# EAGLE design trig3_board_marc1_de0-nano (EAGLE 9.4.2)
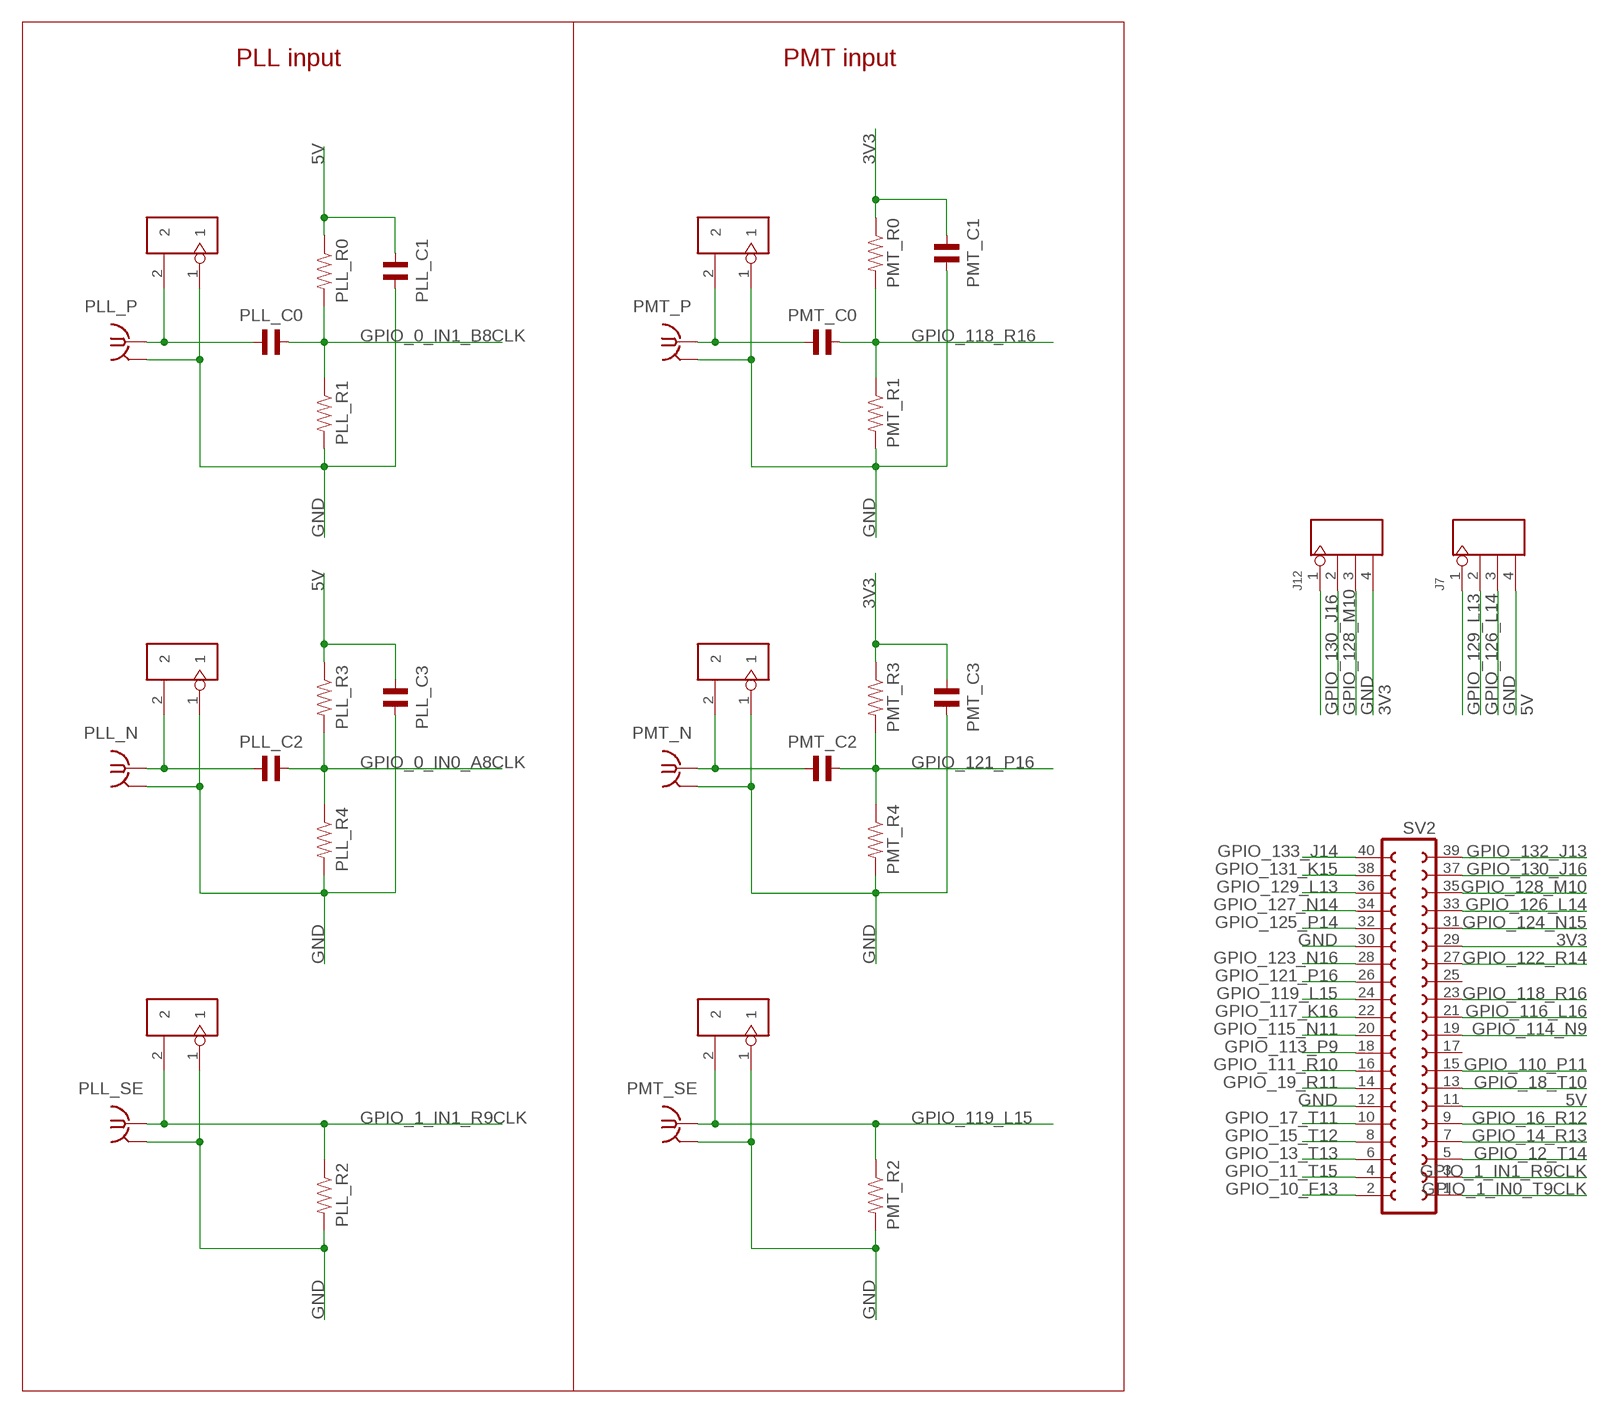
[diagram p0: schematic, sheet 1, part 1 of 2]
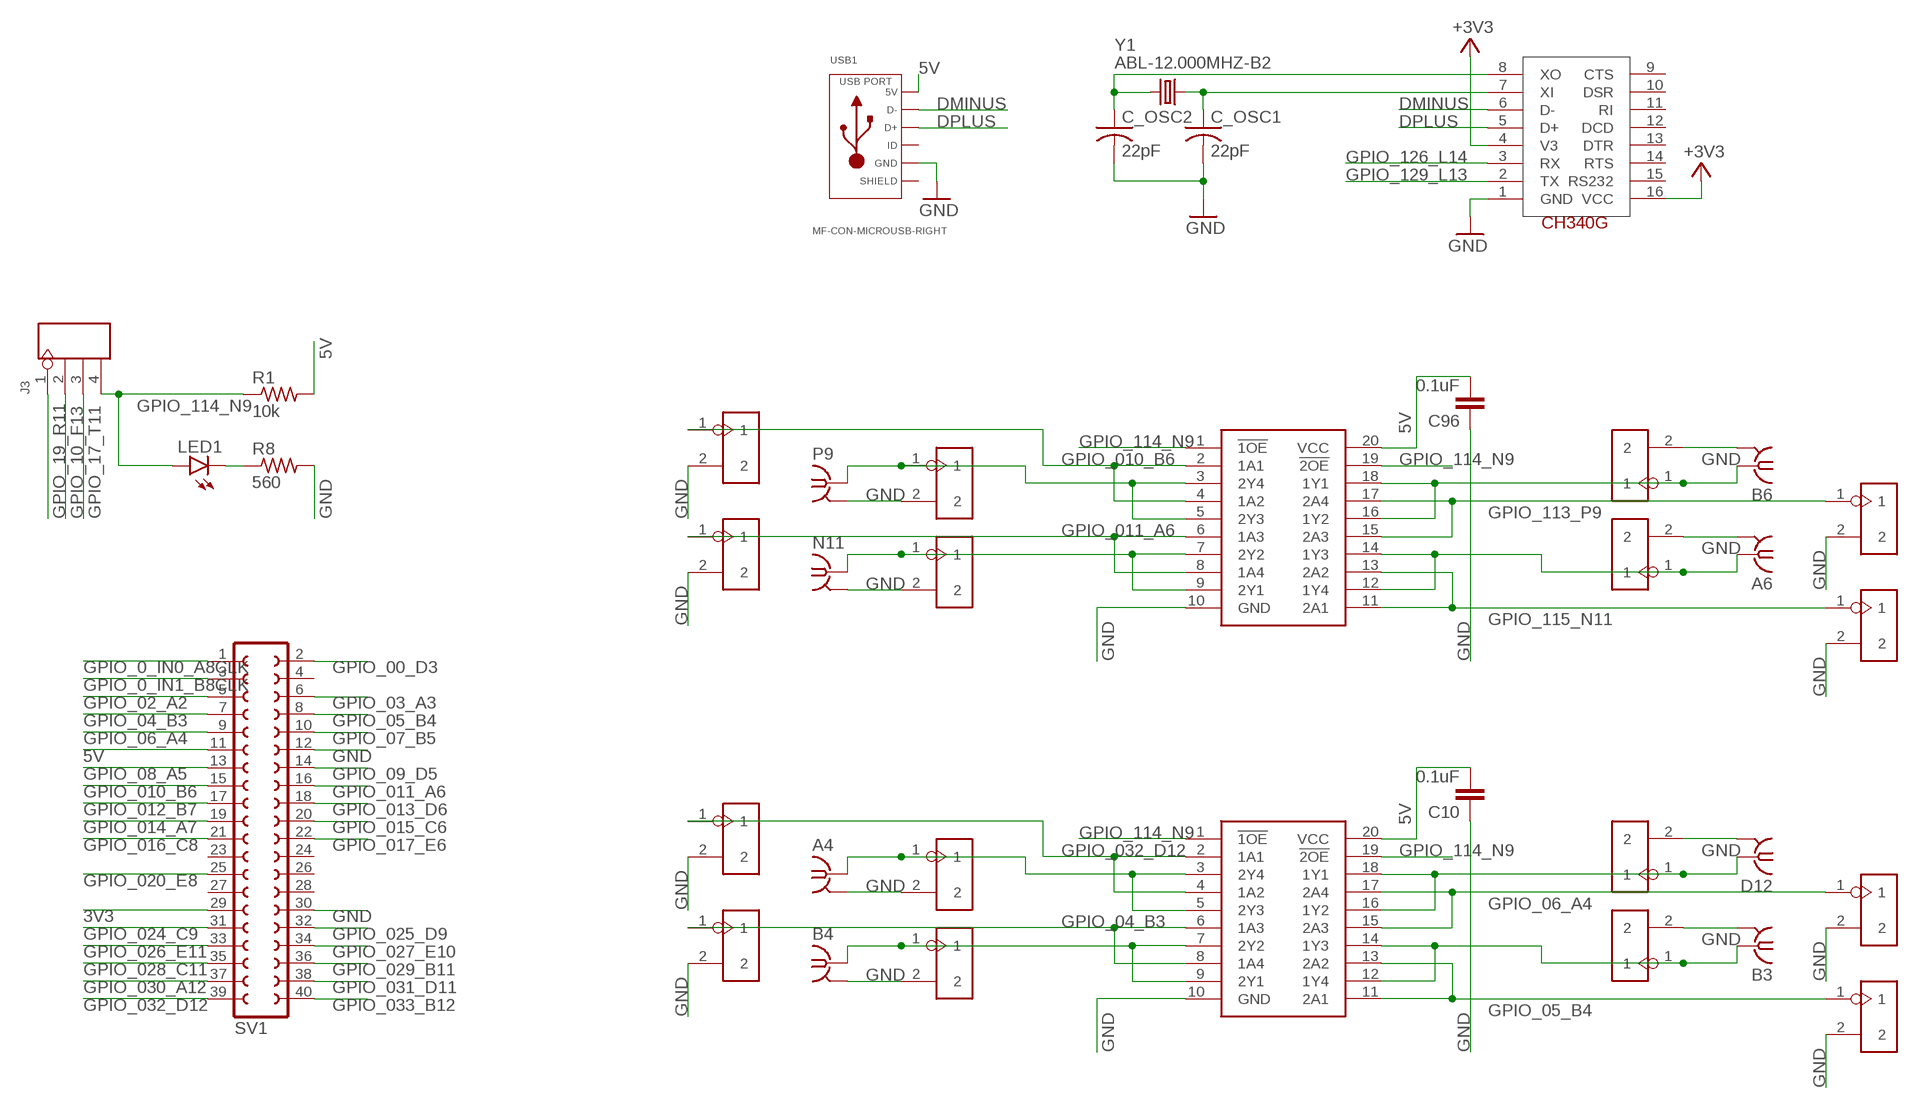
[diagram p1: schematic, sheet 1, part 2 of 2]

## Parts
A4  BU-SMB-V  [BU-SMB-V]
A6  BU-SMB-V  [BU-SMB-V]
B3  BU-SMB-V  [BU-SMB-V]
B4  BU-SMB-V  [BU-SMB-V]
B6  BU-SMB-V  [BU-SMB-V]
C10  0.1uF  CAP0805  [0805]
C96  0.1uF  CAP0805  [0805]
C_OSC1  22pF  C-USC0603  [C0603]
C_OSC2  22pF  C-USC0603  [C0603]
D12  BU-SMB-V  [BU-SMB-V]
J3  4p-2.54  DIP-BLACK-FEMALE-HEADER-VERT(4P-2.54)  [H4-2.54]
J7  4p-2.54  DIP-BLACK-FEMALE-HEADER-VERT(4P-2.54)  [H4-2.54]
J12  4p-2.54  DIP-BLACK-FEMALE-HEADER-VERT(4P-2.54)  [H4-2.54]
LED1  red  LEDCHIP-LED0805  [CHIP-LED0805]
N11  BU-SMB-V  [BU-SMB-V]
OJ41  2p-2.54  DIP-BLACK-MALE-HEADER-VERT(2P-2.54)  [H2-2.54]
OJ42  2p-2.54  DIP-BLACK-MALE-HEADER-VERT(2P-2.54)  [H2-2.54]
OJ43  2p-2.54  DIP-BLACK-MALE-HEADER-VERT(2P-2.54)  [H2-2.54]
OJ44  2p-2.54  DIP-BLACK-MALE-HEADER-VERT(2P-2.54)  [H2-2.54]
OJ45  2p-2.54  DIP-BLACK-MALE-HEADER-VERT(2P-2.54)  [H2-2.54]
OJ46  2p-2.54  DIP-BLACK-MALE-HEADER-VERT(2P-2.54)  [H2-2.54]
OJ47  2p-2.54  DIP-BLACK-MALE-HEADER-VERT(2P-2.54)  [H2-2.54]
OJ48  2p-2.54  DIP-BLACK-MALE-HEADER-VERT(2P-2.54)  [H2-2.54]
OJ89  2p-2.54  DIP-BLACK-MALE-HEADER-VERT(2P-2.54)  [H2-2.54]
OJ90  2p-2.54  DIP-BLACK-MALE-HEADER-VERT(2P-2.54)  [H2-2.54]
OJ91  2p-2.54  DIP-BLACK-MALE-HEADER-VERT(2P-2.54)  [H2-2.54]
OJ92  2p-2.54  DIP-BLACK-MALE-HEADER-VERT(2P-2.54)  [H2-2.54]
OJ93  2p-2.54  DIP-BLACK-MALE-HEADER-VERT(2P-2.54)  [H2-2.54]
OJ94  2p-2.54  DIP-BLACK-MALE-HEADER-VERT(2P-2.54)  [H2-2.54]
OJ95  2p-2.54  DIP-BLACK-MALE-HEADER-VERT(2P-2.54)  [H2-2.54]
OJ96  2p-2.54  DIP-BLACK-MALE-HEADER-VERT(2P-2.54)  [H2-2.54]
P9  BU-SMB-V  [BU-SMB-V]
PLL_C0  1uF  CAPACITOR_NP_0805  [C0805]
PLL_C1  0.1uF  CAPACITOR_NP_0805  [C0805]
PLL_C2  1uF  CAPACITOR_NP_0805  [C0805]
PLL_C3  CAPACITOR_NP_0805  [C0805]
PLL_N  BU-SMB-V  [BU-SMB-V]
PLL_N_J  2p-2.54  DIP-BLACK-MALE-HEADER-VERT(2P-2.54)  [H2-2.54]
PLL_N_J1  2p-2.54  DIP-BLACK-MALE-HEADER-VERT(2P-2.54)  [H2-2.54]
PLL_P  BU-SMB-V  [BU-SMB-V]
PLL_P_J  2p-2.54  DIP-BLACK-MALE-HEADER-VERT(2P-2.54)  [H2-2.54]
PLL_R0  RESISTOR_0805  [R0805]
PLL_R1  RESISTOR_0805  [R0805]
PLL_R2  50ohm  RESISTOR_0805  [R0805]
PLL_R3  RESISTOR_0805  [R0805]
PLL_R4  RESISTOR_0805  [R0805]
PLL_SE  BU-SMB-V  [BU-SMB-V]
PMT_C0  1uF  CAPACITOR_NP_0805  [C0805]
PMT_C1  0.1uF  CAPACITOR_NP_0805  [C0805]
PMT_C2  1uF  CAPACITOR_NP_0805  [C0805]
PMT_C3  CAPACITOR_NP_0805  [C0805]
PMT_N  BU-SMB-V  [BU-SMB-V]
PMT_N_J  2p-2.54  DIP-BLACK-MALE-HEADER-VERT(2P-2.54)  [H2-2.54]
PMT_N_J1  2p-2.54  DIP-BLACK-MALE-HEADER-VERT(2P-2.54)  [H2-2.54]
PMT_P  BU-SMB-V  [BU-SMB-V]
PMT_P_J  2p-2.54  DIP-BLACK-MALE-HEADER-VERT(2P-2.54)  [H2-2.54]
PMT_R0  RESISTOR_0805  [R0805]
PMT_R1  RESISTOR_0805  [R0805]
PMT_R2  50ohm  RESISTOR_0805  [R0805]
PMT_R3  RESISTOR_0805  [R0805]
PMT_R4  RESISTOR_0805  [R0805]
PMT_SE  BU-SMB-V  [BU-SMB-V]
R1  10k  R-US_R0805  [R0805]
R8  560  R-US_R0805  [R0805]
SV1  FE20-2  [FE20-2]
SV2  FE20-2  [FE20-2]
U340G  CH340G  [SOIC16]
USB1  MF-CON-MICROUSB-RIGHT  USB_5PIN_10118193-0001LF  [10118193-0001LF]
VSLUE5  SN74ACT244DW  [SOIC127P1030X265-20N]
VSLUE11  SN74ACT244DW  [SOIC127P1030X265-20N]
Y1  ABL-12.000MHZ-B2  CRYSTALHC49US  [HC49US]

## Nets
3V3 [power]: J12.4 PMT_C1.P$1 PMT_C3.P$1 PMT_R0.P$1 PMT_R3.P$1 SV1.29 SV2.29
5V [power]: C10.2 C96.2 J7.4 PLL_C1.P$1 PLL_C3.P$1 PLL_R0.P$1 PLL_R3.P$1 R1.2 SV1.11 SV2.11 USB1.1(5V) VSLUE5.20(VCC) VSLUE11.20(VCC)
+3V3 [three]: U340G.4(V3) U340G.16(VCC)
DMINUS: U340G.6(D-) USB1.2(D-)
DPLUS: U340G.5(D+) USB1.3(D+)
GND: A4.2 A4.3 A4.4 A4.5 A6.2 A6.3 A6.4 A6.5 B3.2 B3.3 B3.4 B3.5 B4.2 B4.3 B4.4 B4.5 B6.2 B6.3 B6.4 B6.5 C10.1 C96.1 C_OSC1.2 C_OSC2.2 D12.2 D12.3 D12.4 D12.5 J7.3 J12.3 N11.2 N11.3 N11.4 N11.5 OJ41.2 OJ42.2 OJ43.2 OJ44.2 OJ45.2 OJ46.2 OJ47.2 OJ48.2 OJ89.2 OJ90.2 OJ91.2 OJ92.2 OJ93.2 OJ94.2 OJ95.2 OJ96.2 P9.2 P9.3 P9.4 P9.5 PLL_C1.P$2 PLL_C3.P$2 PLL_N.2 PLL_N.3 PLL_N.4 PLL_N.5 PLL_N_J1.1 PLL_N_J.1 PLL_P.2 PLL_P.3 PLL_P.4 PLL_P.5 PLL_P_J.1 PLL_R1.P$2 PLL_R2.P$2 PLL_R4.P$2 PLL_SE.2 PLL_SE.3 PLL_SE.4 PLL_SE.5 PMT_C1.P$2 PMT_C3.P$2 PMT_N.2 PMT_N.3 PMT_N.4 PMT_N.5 PMT_N_J1.1 PMT_N_J.1 PMT_P.2 PMT_P.3 PMT_P.4 PMT_P.5 PMT_P_J.1 PMT_R1.P$2 PMT_R2.P$2 PMT_R4.P$2 PMT_SE.2 PMT_SE.3 PMT_SE.4 PMT_SE.5 R8.2 SV1.12 SV1.30 SV2.12 SV2.30 U340G.1(GND) USB1.5(GND) VSLUE5.10(GND) VSLUE11.10(GND)
GPIO_00_D3: SV1.2
GPIO_0_IN0_A8CLK: PLL_C2.P$2 PLL_R3.P$2 PLL_R4.P$1 SV1.1
GPIO_0_IN1_B8CLK: PLL_C0.P$2 PLL_R0.P$2 PLL_R1.P$1 SV1.3
GPIO_1_IN0_T9CLK: SV2.1
GPIO_1_IN1_R9CLK: PLL_N_J1.2 PLL_R2.P$1 PLL_SE.1 SV2.3
GPIO_02_A2: SV1.5
GPIO_03_A3: SV1.6
GPIO_04_B3: OJ96.1 SV1.7 VSLUE11.6(1A3) VSLUE11.8(1A4)
GPIO_05_B4: OJ94.1 SV1.8 VSLUE11.11(2A1) VSLUE11.13(2A2)
GPIO_06_A4: OJ93.1 SV1.9 VSLUE11.15(2A3) VSLUE11.17(2A4)
GPIO_07_B5: SV1.10
GPIO_08_A5: SV1.13
GPIO_09_D5: SV1.14
GPIO_010_B6: OJ47.1 SV1.15 VSLUE5.2(1A1) VSLUE5.4(1A2)
GPIO_10_F13: J3.2 SV2.2
GPIO_011_A6: OJ48.1 SV1.16 VSLUE5.6(1A3) VSLUE5.8(1A4)
GPIO_11_T15: SV2.4
GPIO_012_B7: SV1.17
GPIO_12_T14: SV2.5
GPIO_013_D6: SV1.18
GPIO_13_T13: SV2.6
GPIO_014_A7: SV1.19
GPIO_14_R13: SV2.7
GPIO_015_C6: SV1.20
GPIO_15_T12: SV2.8
GPIO_016_C8: SV1.21
GPIO_16_R12: SV2.9
GPIO_017_E6: SV1.22
GPIO_17_T11: J3.3 SV2.10
GPIO_18_T10: SV2.13
GPIO_19_R11: J3.1 SV2.14
GPIO_020_E8: SV1.25
GPIO_024_C9: SV1.31
GPIO_025_D9: SV1.32
GPIO_026_E11: SV1.33
GPIO_027_E10: SV1.34
GPIO_028_C11: SV1.35
GPIO_029_B11: SV1.36
GPIO_030_A12: SV1.37
GPIO_031_D11: SV1.38
GPIO_032_D12: OJ95.1 SV1.39 VSLUE11.2(1A1) VSLUE11.4(1A2)
GPIO_033_B12: SV1.40
GPIO_110_P11: SV2.15
GPIO_111_R10: SV2.16
GPIO_113_P9: OJ45.1 SV2.18 VSLUE5.15(2A3) VSLUE5.17(2A4)
GPIO_114_N9: J3.4 LED1.A R1.1 SV2.19 VSLUE5.1(!1OE) VSLUE5.19(!2OE) VSLUE11.1(!1OE) VSLUE11.19(!2OE)
GPIO_115_N11: OJ46.1 SV2.20 VSLUE5.11(2A1) VSLUE5.13(2A2)
GPIO_116_L16: SV2.21
GPIO_117_K16: SV2.22
GPIO_118_R16: PMT_C0.P$2 PMT_R0.P$2 PMT_R1.P$1 SV2.23
GPIO_119_L15: PMT_N_J1.2 PMT_R2.P$1 PMT_SE.1 SV2.24
GPIO_121_P16: PMT_C2.P$2 PMT_R3.P$2 PMT_R4.P$1 SV2.26
GPIO_122_R14: SV2.27
GPIO_123_N16: SV2.28
GPIO_124_N15: SV2.31
GPIO_125_P14: SV2.32
GPIO_126_L14: J7.2 SV2.33 U340G.3(RX)
GPIO_127_N14: SV2.34
GPIO_128_M10: J12.2 SV2.35
GPIO_129_L13: J7.1 SV2.36 U340G.2(TX)
GPIO_130_J16: J12.1 SV2.37
GPIO_131_K15: SV2.38
GPIO_132_J13: SV2.39
GPIO_133_J14: SV2.40
N$2: PMT_C0.P$1 PMT_P.1 PMT_P_J.2
N$8: PMT_C2.P$1 PMT_N.1 PMT_N_J.2
N$9: LED1.C R8.1
N$14: PLL_C0.P$1 PLL_P.1 PLL_P_J.2
N$19: PLL_C2.P$1 PLL_N.1 PLL_N_J.2
N$23: C_OSC1.1 U340G.7(XI) Y1.1
N$31: C_OSC2.1 U340G.8(XO) Y1.2
OUT21: B6.1 OJ44.1 VSLUE5.16(1Y2) VSLUE5.18(1Y1)
OUT22: A6.1 OJ43.1 VSLUE5.12(1Y4) VSLUE5.14(1Y3)
OUT23: OJ41.1 P9.1 VSLUE5.3(2Y4) VSLUE5.5(2Y3)
OUT24: N11.1 OJ42.1 VSLUE5.7(2Y2) VSLUE5.9(2Y1)
OUT45: D12.1 OJ92.1 VSLUE11.16(1Y2) VSLUE11.18(1Y1)
OUT46: B3.1 OJ91.1 VSLUE11.12(1Y4) VSLUE11.14(1Y3)
OUT47: A4.1 OJ89.1 VSLUE11.3(2Y4) VSLUE11.5(2Y3)
OUT48: B4.1 OJ90.1 VSLUE11.7(2Y2) VSLUE11.9(2Y1)
Unconnected: SV1.4 SV1.23 SV1.24 SV1.26 SV1.27 SV1.28 SV2.17 SV2.25 U340G.9(CTS) U340G.10(DSR) U340G.11(RI) U340G.12(DCD) U340G.13(DTR) U340G.14(RTS) U340G.15(RS232) USB1.4(ID)

## Notes on the sheet
- PLL input | PMT input

## Power pins joined to a net without a drawn wire
SLD: USB1.S1(SLD) USB1.S2(SLD) USB1.S3(SLD) USB1.S4(SLD)

## Library data of the parts
A4 A6 B3 B4 B6 D12 N11 P9 PLL_N PLL_P PLL_SE PMT_N PMT_P PMT_SE = con-coax:BU-SMB-V: FEMALE SMB CONNECTOR Radiall distributor RS 112-2993; OC_FARNELL: unknown; OC_NEWARK: unknown
C10 C96 = SparkFun-Capacitors:CAP: Capacitor Standard 0603 ceramic capacitor, and 0.1" leaded capacitor.
C_OSC1 C_OSC2 = rcl@1:C-US: CAPACITOR, American symbol; MFN: MF-CAP-0603-22pF
J3 J7 J12 = Seeed-Connector:DIP-BLACK-FEMALE-HEADER-VERT(4P-2.54): 320030017; MPN: F185-1104A1BSYA1
LED1 = led:LED: LED OSRAM: - CHIPLED LG R971, LG N971, LY N971, LG Q971, LY Q971, LO R971, LY R971 LH N974, LH R974 LS Q976, LO Q976, LY Q976 LO Q996 - Hyper CHIPLED LW Q18S LB Q993, LB Q99A, LB R99A - SideLED LS A670, LO A670, LY A670, LG A670, LP A670 LB A673, LV A673, LT A673, LW A673 LH A674 LY A675 LS A676, LA A676, LO A676, LY A676, LW A676 LS A679, LY A679, LG A679 - Hyper Micro SIDELED® LS Y876, LA Y876, LO Y876, LY Y876 LT Y87S - SmartLED LW L88C, LW L88S LB L89C, LB L89S, LG L890 LS L89K, LO L89K, LY L89K LS L896, LA L896, LO L896, LY L896 - TOPLED LS T670, LO T670, LY T670, LG T670, LP T670 LSG T670, LSP T670, LSY T670, LOP T670, LYG T670 LG T671, LOG T671, LSG T671 LB T673, LV T673, LT T673, LW T673 LH T674 LS T676, LA T676, LO T676, LY T676, LB T676, LH T676, LSB T676, LW T676 LB T67C, LV T67C, LT T67C, LS T67K, LO T67K, LY T67K, LW E67C LS E67B, LA E67B, LO E67B, LY E67B, LB E67C, LV E67C, LT E67C LW T67C LS T679, LY T679, LG T679 LS T770, LO T770, LY T770, LG T770, LP T770 LB T773, LV T773, LT T773, LW T773 LH T774 LS E675, LA E675, LY E675, LS T675 LS T776, LA T776, LO T776, LY T776, LB T776 LHGB T686 LT T68C, LB T68C - Hyper Mini TOPLED® LB M676 - Mini TOPLED Santana® LG M470 LS M47K, LO M47K, LY M47K Source: http://www.osram.convergy.de LUXEON: - LUMILED® LXK2-PW12-R00, LXK2-PW12-S00, LXK2-PW14-U00, LXK2-PW14-V00 LXK2-PM12-R00, LXK2-PM12-S00, LXK2-PM14-U00 LXK2-PE12-Q00, LXK2-PE12-R00, LXK2-PE12-S00, LXK2-PE14-T00, LXK2-PE14-U00 LXK2-PB12-K00, LXK2-PB12-L00, LXK2-PB12-M00, LXK2-PB14-N00, LXK2-PB14-P00, LXK2-PB14-Q00 LXK2-PR12-L00, LXK2-PR12-M00, LXK2-PR14-Q00, LXK2-PR14-R00 LXK2-PD12-Q00, LXK2-PD12-R00, LXK2-PD12-S00 LXK2-PH12-R00, LXK2-PH12-S00 LXK2-PL12-P00, LXK2-PL12-Q00, LXK2-PL12-R00 Source: www.luxeon.com KINGBRIGHT: KA-3528ASYC Source: www.kingbright.com
OJ41-OJ48 OJ89-OJ96 PLL_N_J PLL_N_J1 PLL_P_J PMT_N_J PMT_N_J1 PMT_P_J = Seeed-Connector:DIP-BLACK-MALE-HEADER-VERT(2P-2.54): 320020016; MPN: P125-1102A0BS116A1
PLL_C0 PLL_C1-PLL_C3 PMT_C0 PMT_C1-PMT_C3 = MF_Passives:CAPACITOR_NP: Library: MF_Passives Description: Device for Non-Polarized Capacitors. Manufacture part number (MPN) can be added via Attributes. Check https://factory.macrofab.com/parts for the house parts list.; POPULATE: 1
PLL_R0 PLL_R1-PLL_R4 PMT_R0 PMT_R1-PMT_R4 = MF_Passives:RESISTOR: Library: MF_Passives Description: Device for Resistors. Manufacture part number (MPN), Voltage, Tolerance, and Wattage Rating can be added via Attributes. Check https://factory.macrofab.com/parts for the house parts list.; POPULATE: 1
R1 = adafruit:R-US_: RESISTOR, American symbol
R8 = resistor:R-US_: RESISTOR, American symbol
SV1 SV2 = con-lsta:FE20-2: FEMALE HEADER; OC_FARNELL: unknown; OC_NEWARK: unknown
U340G = usb-serial:CH340G
USB1 = PP_Connectors:USB_5PIN; POPULATE: 1
VSLUE5 VSLUE11 = SN74ACT244DW:SN74ACT244DW: SN74ACT244DW, 8-Bit Buffer, Line Driver, ACT, 3-State Non-Inverting 4.5 5.5 V 20-Pin SOIC Source: Datasheet <http://www.ti.com/lit/ds/symlink/sn74act244.pdf>; ARROW_PART_NUMBER: SN74ACT244DW; ARROW_PRICE-STOCK: https://www.arrow.com/en/products/sn74act244dw/texas-instruments; DESCRIPTION: SN74ACT244DW, 8-Bit Buffer, Line Driver, ACT, 3-State Non-Inverting 4.5 5.5 V 20-Pin SOIC; HEIGHT: 2.65mm; MANUFACTURER_NAME: Texas Instruments; MANUFACTURER_PART_NUMBER: SN74ACT244DW; RS_PART_NUMBER: 4363169; RS_PRICE-STOCK: http://uk.rs-online.com/web/p/products/4363169
Y1 = SparkFun-FreqCtrl:CRYSTAL: Various standard crystals. Proven footprints.

## Net classes
0 default: width 0.254 mm
1 power: width 0.762 mm
2 three: width 0.152 mm
3 five: width 0.381 mm

## Board
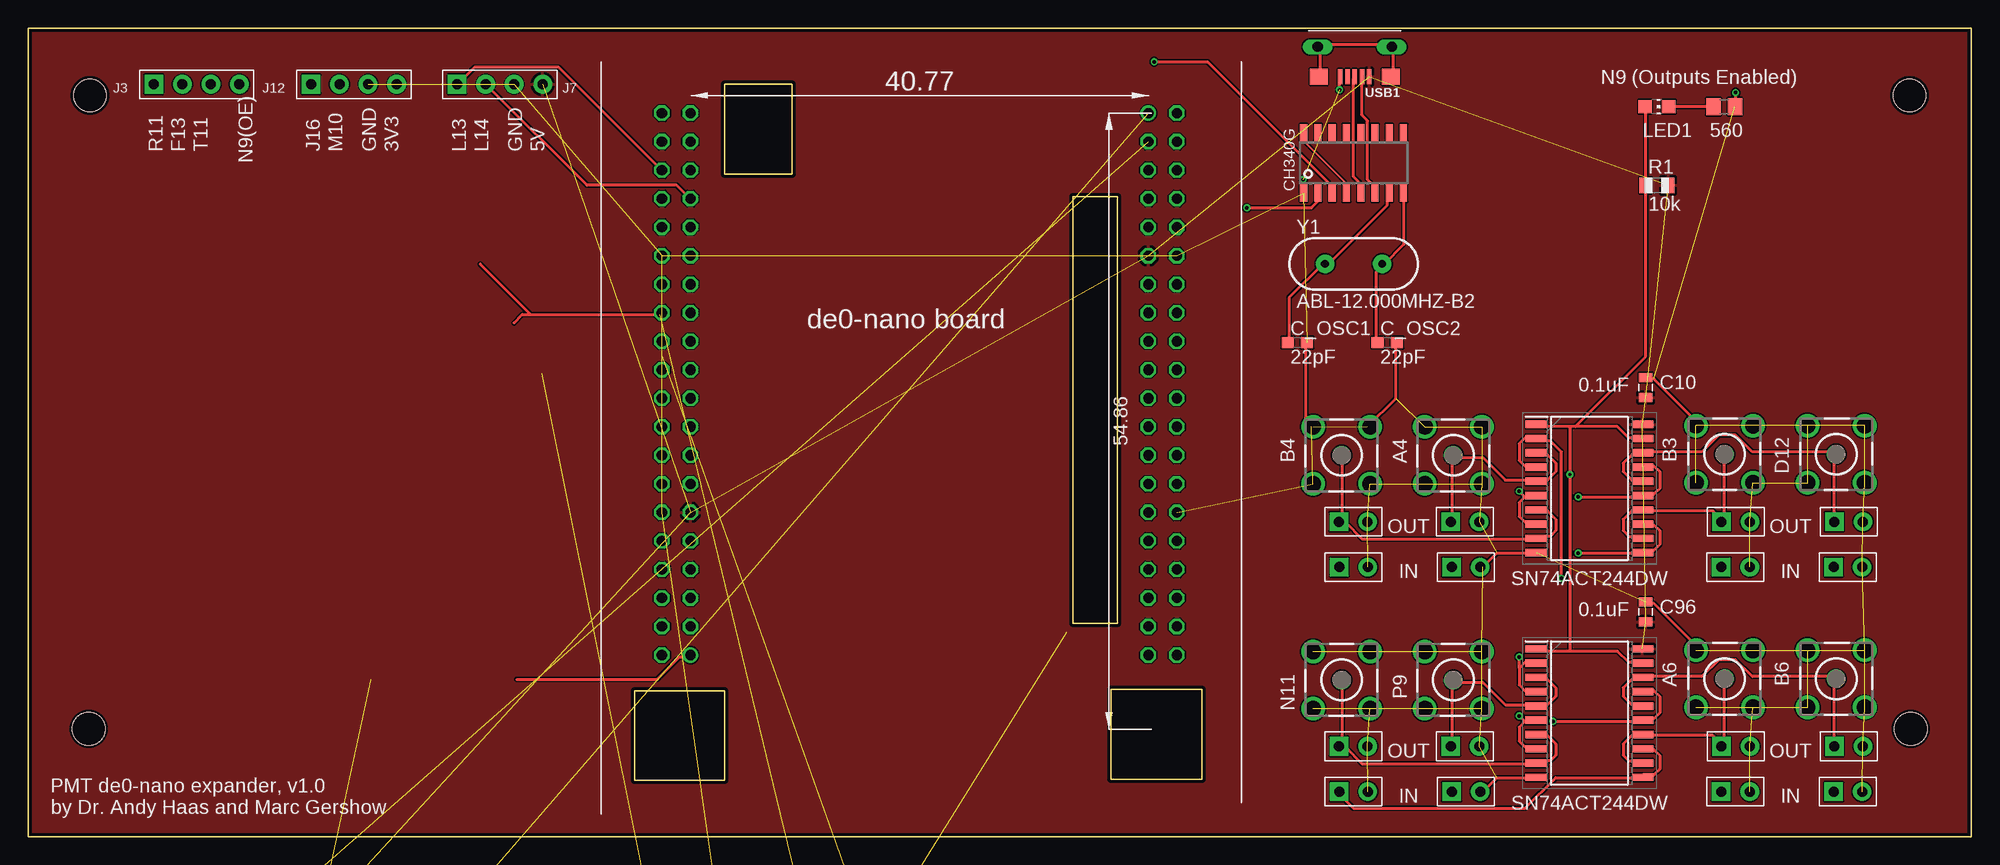
[diagram p2: board, top side]
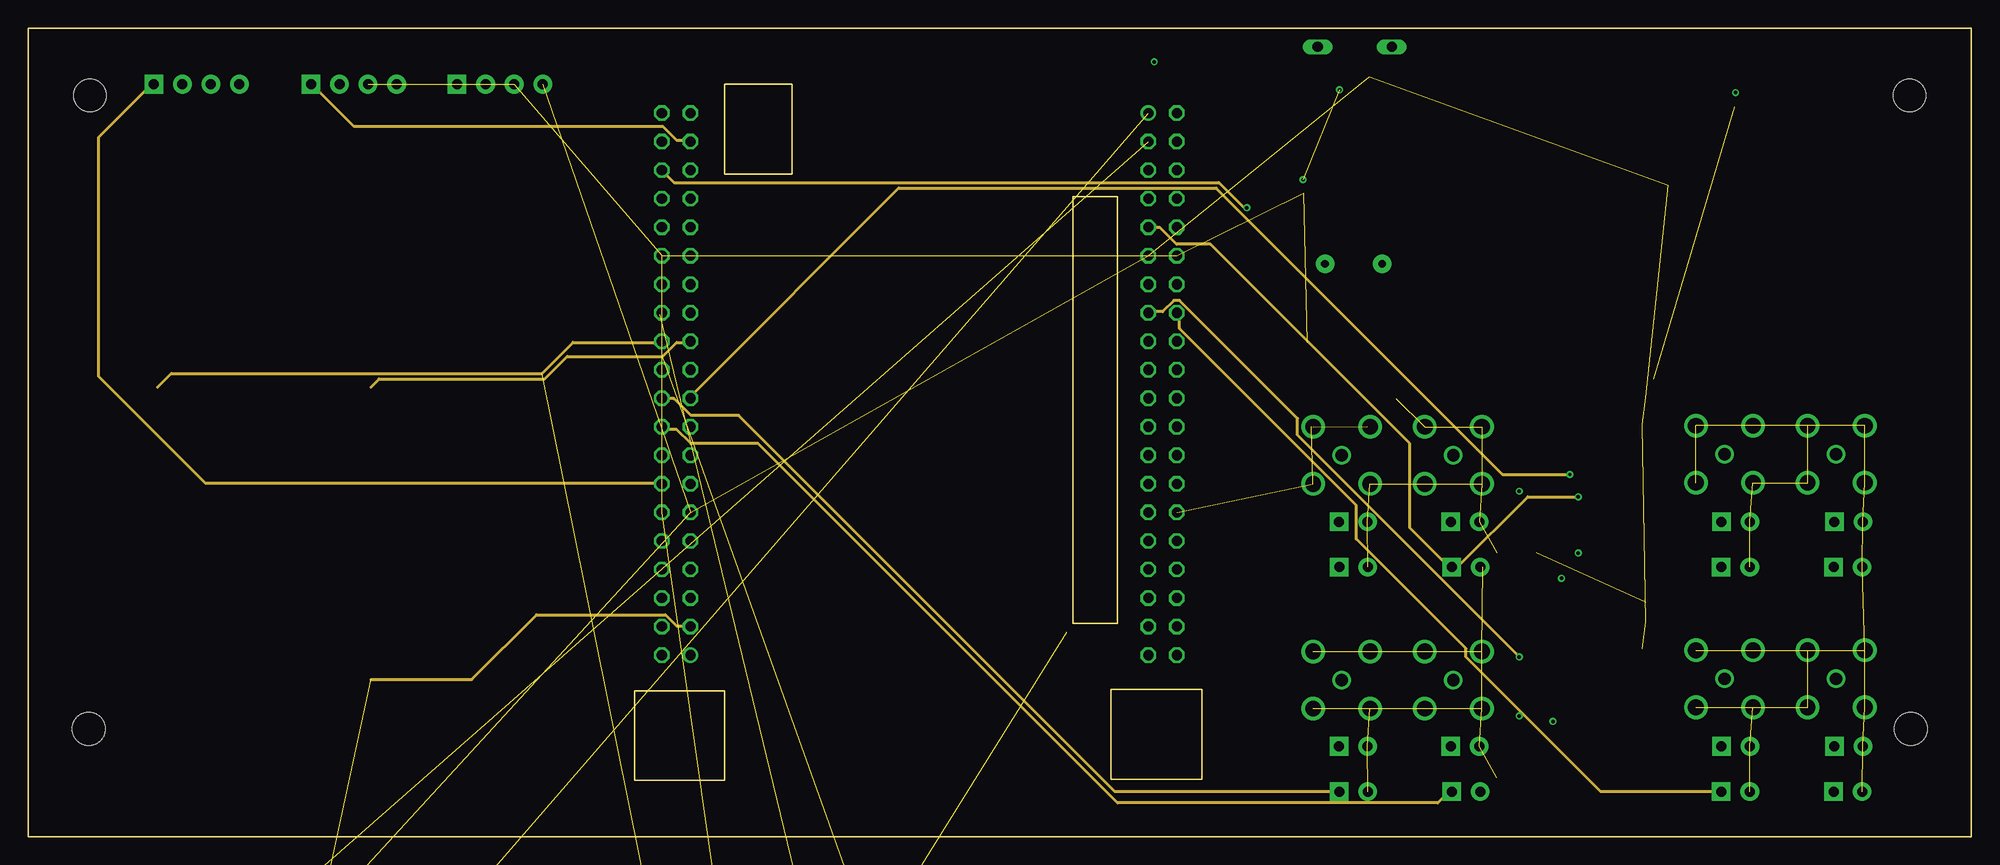
[diagram p3: board, inner layer Route2]
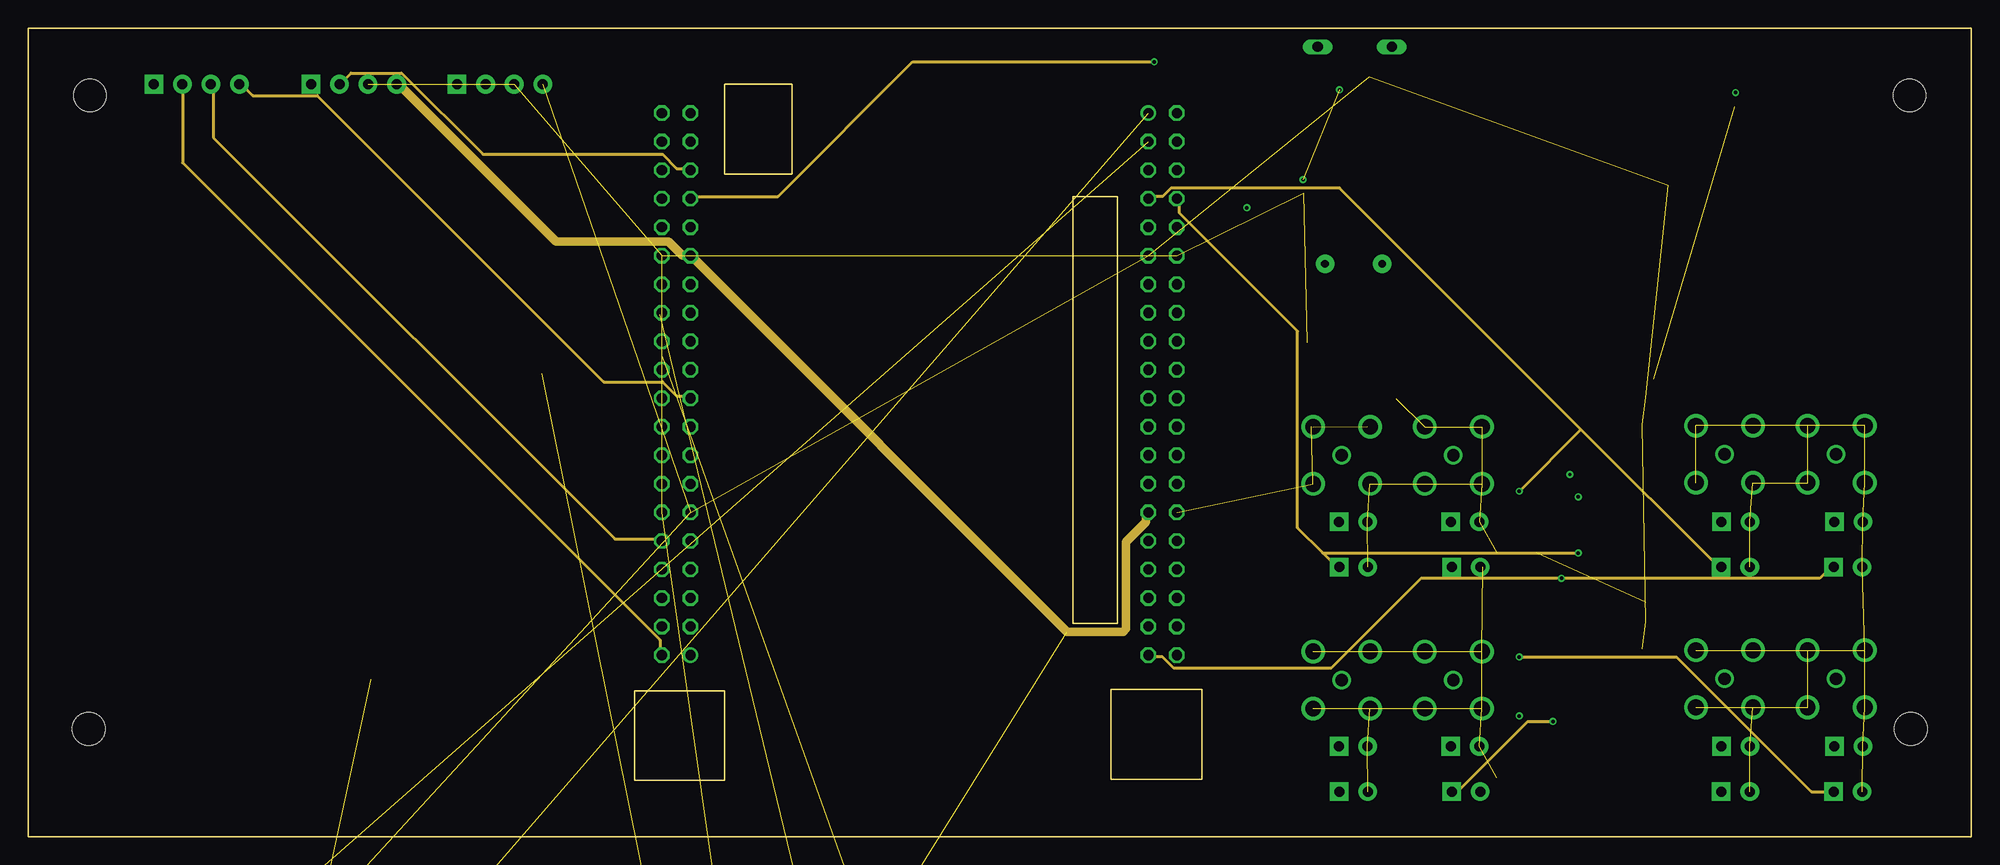
[diagram p4: board, inner layer Route15]
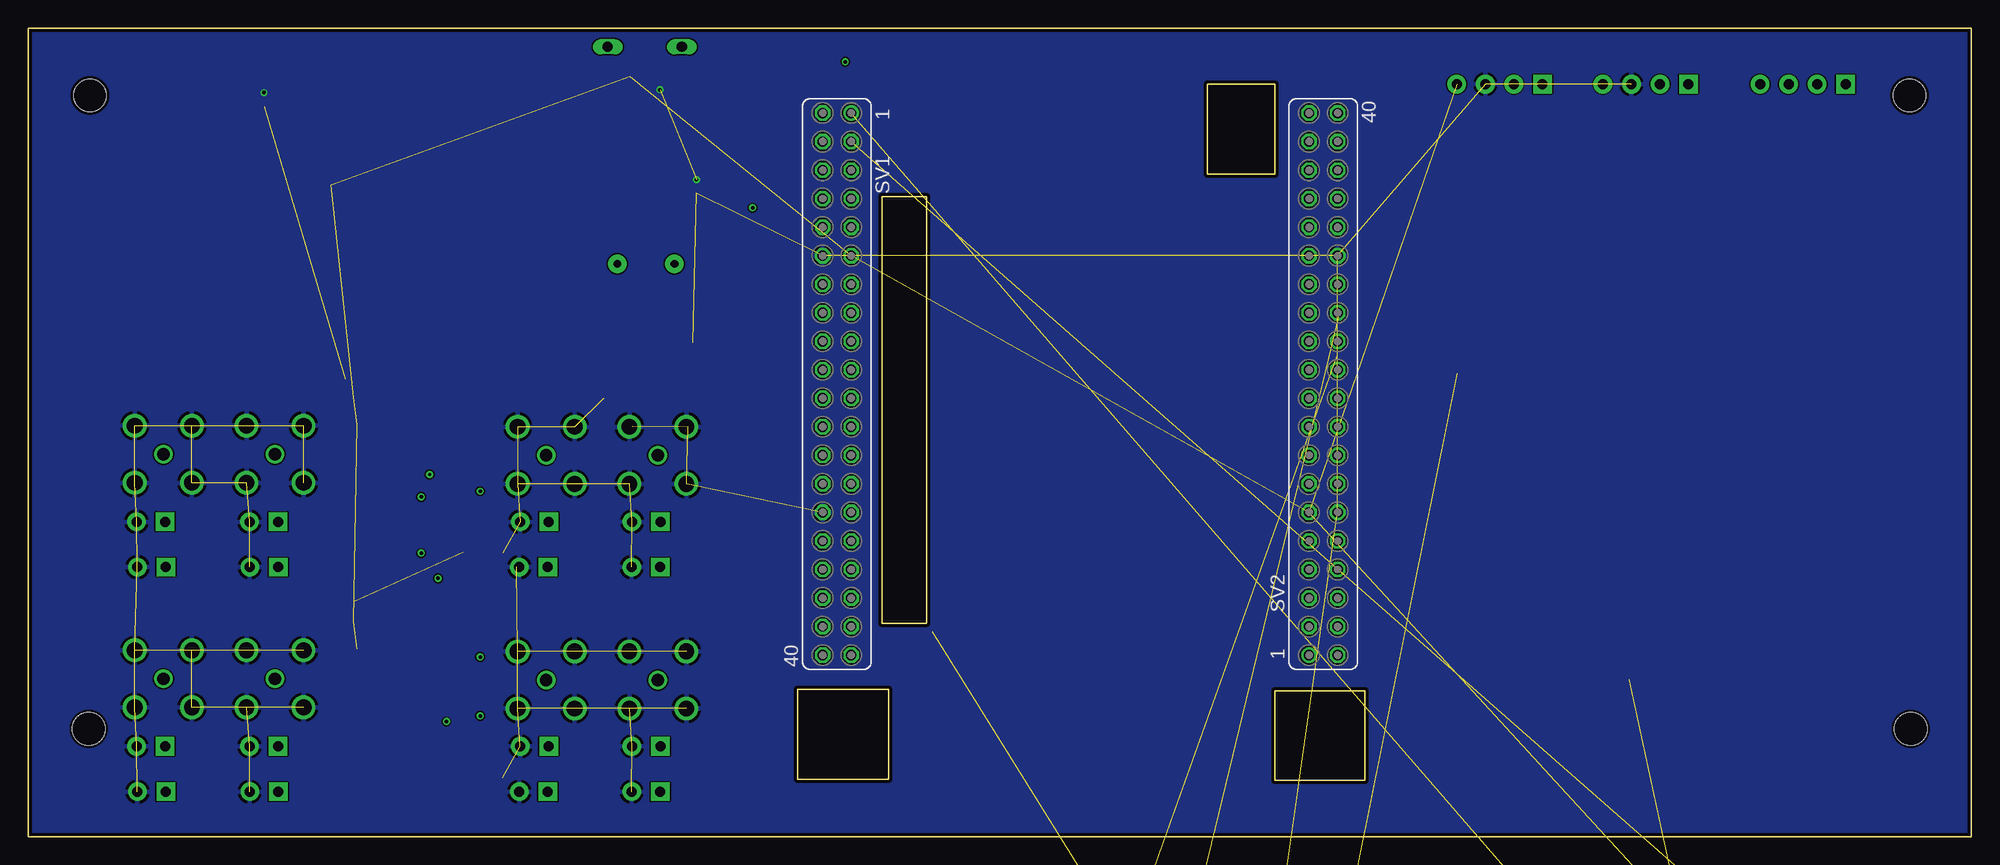
[diagram p5: board, bottom side, seen from below]

Size 173 x 72 mm. Coordinates in mm from the lower left corner, seen from the top.
Outline: 104.5,13.1 104.5,5.1 96.4,5.1 96.4,13.1 104.5,13.1
Outline: 62,13 62,5 54,5 54,13 62,13
Outline: 97,57 97,19 93,19 93,57 97,57
Outline: 62,59 62,67 68,67 68,59 62,59
Outline: 0,72 0,0 173,0 173,72 0,72
Copper layers (1*2*15*16): Top 0.035mm / dielectric 0.23mm / Route2 0.035mm / dielectric 0.93mm / Route15 0.035mm / dielectric 0.23mm / Bottom 0.035mm
Design rules "MF_Standard_4_Layer": minimum track width 5mil, minimum drill 12mil, track to track 5mil, track to pad 5mil, pad to pad 5mil, via to via 5mil, smd to smd 0mil, copper to edge 10mil, drill to drill 10mil, minimum pad ring 6mil, minimum via ring 6mil, stop-mask expansion 2mil, vias tented up to drill 25mil, thermal gap 10mil
Holes 2.9 mm at 5.4,9.6 167.6,9.6 5.5,66 167.5,66

### Footprints (pad centres in the part's own frame; a part is rotated, then mirrored left to right if it is on the bottom)
BU-SMB-V = drill 1.1: 1 0,0 | drill 1.4: 2 -2.54,2.54; 3 2.54,2.54; 4 2.54,-2.54; 5 -2.54,-2.54
0805 = smd 0.8 x 1.2: 1 -0.9,0; 2 0.9,0
C0603 = smd 1.1 x 1: 1 -0.85,0; 2 0.85,0
H4-2.54 = drill 0.889 pad 1.651 square: 1 0,3.81 | drill 0.889 pad 1.651: 2 0,1.27; 3 0,-1.27; 4 0,-3.81
CHIP-LED0805 = smd 1.2 x 1.2: A 0,-1.05; C 0,1.05
H2-2.54 = drill 0.889 pad 1.651 square: 1 0,1.27 | drill 0.889 pad 1.651: 2 0,-1.27
C0805 = smd 0.7 x 1.3: P$1 -0.95,0; P$2 0.95,0
R0805 = smd 0.7 x 1.3: P$1 -0.95,0; P$2 0.95,0
R0805' = smd 1.1 x 1.4: 1 -1,0; 2 1,0
R0805'' = smd 1.3 x 1.5: 1 -0.95,0; 2 0.95,0
FE20-2 = drill 0.914: 1 -24.13,1.27 | drill 0.914 octagon: 2 -24.13,-1.27; 3 -21.59,1.27; 4 -21.59,-1.27; 5 -19.05,1.27; 6 -19.05,-1.27; 7 -16.51,1.27; 8 -16.51,-1.27; 9 -13.97,1.27; 10 -13.97,-1.27; 11 -11.43,1.27; 12 -11.43,-1.27; 13 -8.89,1.27; 14 -8.89,-1.27; 15 -6.35,1.27; 16 -6.35,-1.27; 17 -3.81,1.27; 18 -3.81,-1.27; 19 -1.27,1.27; 20 -1.27,-1.27; 21 1.27,1.27; 22 1.27,-1.27; 23 3.81,1.27; 24 3.81,-1.27; 25 6.35,1.27; 26 6.35,-1.27; 27 8.89,1.27; 28 8.89,-1.27; 29 11.43,1.27; 30 11.43,-1.27; 31 13.97,1.27; 32 13.97,-1.27; 33 16.51,1.27; 34 16.51,-1.27; 35 19.05,1.27; 36 19.05,-1.27; 37 21.59,1.27; 38 21.59,-1.27; 39 24.13,1.27; 40 24.13,-1.27
SOIC16 = smd 0.635 x 1.524: 1 -4.445,-2.695; 2 -3.175,-2.695; 3 -1.905,-2.695; 4 -0.635,-2.695; 5 0.635,-2.695; 6 1.905,-2.695; 7 3.175,-2.695; 8 4.445,-2.695; 9 4.445,2.695; 10 3.175,2.695; 11 1.905,2.695; 12 0.635,2.695; 13 -0.635,2.695; 14 -1.905,2.695; 15 -3.175,2.695; 16 -4.445,2.695
10118193-0001LF = smd 0.4 x 1.35: 1 -1.3,2.54; 2 -0.65,2.54; 3 0,2.54; 4 0.65,2.54; 5 1.3,2.54 | drill 0.9 long: S1 -3.3,-0.135; S2 3.3,-0.135 | smd 1.6 x 1.4: S3 -3.2,2.54; S4 3.2,2.54
SOIC127P1030X265-20N = smd 1.95 x 0.65: 1 -4.725,5.715; 2 -4.725,4.445; 3 -4.725,3.175; 4 -4.725,1.905; 5 -4.725,0.635; 6 -4.725,-0.635; 7 -4.725,-1.905; 8 -4.725,-3.175; 9 -4.725,-4.445; 10 -4.725,-5.715; 11 4.725,-5.715; 12 4.725,-4.445; 13 4.725,-3.175; 14 4.725,-1.905; 15 4.725,-0.635; 16 4.725,0.635; 17 4.725,1.905; 18 4.725,3.175; 19 4.725,4.445; 20 4.725,5.715
HC49US = drill 0.7 pad 1.651: 1 -2.54,0; 2 2.54,0

### Placement (x,y rotation side)
A4  126.88,33.95 180 top
A6  151.02,14.05 0 top
B3  151.02,34.05 0 top
B4  116.93,33.95 180 top
B6  160.96,14.05 0 top
C10  144,40 270 top
C96  144,20 270 top
C_OSC1  113,44 0 top
C_OSC2  121,44 0 top
D12  160.96,34.05 0 top
J3  15,67 90 top
J7  42,67 90 top
J12  29,67 90 top
LED1  145,65 270 top
N11  116.93,13.95 180 top
OJ41  127.92,8.04 90 top
OJ42  117.97,8.04 90 top
OJ43  152.02,8.04 90 top
OJ44  162.07,8.04 90 top
OJ45  128,4 90 top
OJ46  118,4 90 top
OJ47  162,4 90 top
OJ48  152,4 90 top
OJ89  127.92,28.04 90 top
OJ90  117.97,28.04 90 top
OJ91  152.02,28.04 90 top
OJ92  162.07,28.04 90 top
OJ93  128,24 90 top
OJ94  118,24 90 top
OJ95  162,24 90 top
OJ96  152,24 90 top
P9  126.88,13.95 180 top
PLL_C0  17,-10 0 top  (outside the outline)
PLL_C1  17,-14 0 top  (outside the outline)
PLL_C2  17,-30 0 top  (outside the outline)
PLL_C3  17,-34 0 top  (outside the outline)
PLL_N  10,-36 0 top  (outside the outline)
PLL_N_J  3,-36 0 top  (outside the outline)
PLL_N_J1  3,-53 0 top  (outside the outline)
PLL_P  7,-16 0 top  (outside the outline)
PLL_P_J  0,-16 0 top  (outside the outline)
PLL_R0  17,-18 0 top  (outside the outline)
PLL_R1  17,-22 0 top  (outside the outline)
PLL_R2  17,-53 0 top  (outside the outline)
PLL_R3  17,-38 0 top  (outside the outline)
PLL_R4  17,-42 0 top  (outside the outline)
PLL_SE  9,-53 0 top  (outside the outline)
PMT_C0  74,-9 0 top  (outside the outline)
PMT_C1  74,-13 0 top  (outside the outline)
PMT_C2  74,-31 0 top  (outside the outline)
PMT_C3  74,-35 0 top  (outside the outline)
PMT_N  65,-36 0 top  (outside the outline)
PMT_N_J  58,-36 0 top  (outside the outline)
PMT_N_J1  58,-54 0 top  (outside the outline)
PMT_P  65,-16 0 top  (outside the outline)
PMT_P_J  59,-16 0 top  (outside the outline)
PMT_R0  74,-17 0 top  (outside the outline)
PMT_R1  74,-21 0 top  (outside the outline)
PMT_R2  74,-54 0 top  (outside the outline)
PMT_R3  74,-39 0 top  (outside the outline)
PMT_R4  74,-43 0 top  (outside the outline)
PMT_SE  65,-54 0 top  (outside the outline)
R1  10k  [R0805']  145,58 0 top
R8  560  [R0805'']  151,65 0 top
SV1  101,40.3 270 bottom
SV2  57.7,40.3 90 bottom
U340G  118,60 0 top
USB1  118.1,70.2 180 top
VSLUE5  139,11 0 top
VSLUE11  139,31 0 top
Y1  118,51 0 top

### Tracks (layer width: path | path; a pad name or v marks a point on that pad's centre or on a via)
3V3  (4 unrouted)
  Route15 0.762: J12.4 33,67 47,53 57,53 58.25,51.75 58.75,51.75 SV2.29 59.25,51.5 92.5,18.25 97.5,18.25 97.75,18.5 97.75,26.25 99.5,28 99.5,28.75 SV1.29
5V  (12 unrouted)
  pour Top: -6,75 177,75 177,-4 -6,-4
+3V3
  Top 0.152: U340G.4 117.25,57.5 117.25,58.25 113.5,62 113.5,62.5 U340G.16
DMINUS
  Top 0.254: USB1.2 118.75,64.25 119.25,63.75 119.25,58.5 119.75,58 119.75,57.5 U340G.6
DPLUS
  Top 0.254: USB1.3 118,67.5 118,58.75 118.75,58 118.75,57.5 U340G.5
GND  (via drill 0.3)  (96 unrouted)
  Top 0.254: C_OSC1.2 113.75,44 113.75,37 114.25,36.5 B4.4 | C_OSC2.2 121.75,44 121.75,39 119.25,36.5 B4.5 | C96.1 144,20.75 144.75,20.75 148.25,17.25 148.25,16.75 A6.2 | C10.1 144,40.75 144.75,40.75 148.25,37.25 148.25,36.75 B3.2 | v116.75,66.5 116.75,67.5 USB1.5 | v152,66.25 152,65 R8.2 | v113.5,58.5 113.5,57.5 U340G.1 | VSLUE5.10 134.25,5.25 130.75,5.25 129.5,4 OJ45.2 | VSLUE11.10 134.25,25.25 130.75,25.25 129.5,24 OJ93.2
  pour Bottom: 175,77 175,-2 -2,-2 -2,77
GPIO_0_IN0_A8CLK  (3 unrouted)
GPIO_0_IN1_B8CLK  (3 unrouted)
GPIO_1_IN0_T9CLK
  Top 0.254: 43.5,14 56,14 58,16 58.75,16 SV2.1
GPIO_1_IN1_R9CLK  (3 unrouted)
  Route2 0.254: 30.5,14 39.5,14 45.25,19.75 56.75,19.75 57.75,18.75 58.75,18.75 SV2.3
GPIO_04_B3  (via drill 0.3)
  Top 0.254: 133.25,30.25 132.75,29.75 132.75,28.5 133.25,28 134.25,28 VSLUE11.8 | 133.25,30.25 134.25,30.25 VSLUE11.6 | v132.75,30.75 133.25,30.25
  Route15 0.254: 138.25,36.25 150.5,24 OJ96.1 | 138.25,36.25 116.75,57.75 101.75,57.75 101,57 99.75,57 SV1.7 | 138.25,36.25 v132.75,30.75
GPIO_05_B4  (via drill 0.3)
  Top 0.254: VSLUE11.13 143.75,27.75 144.75,27.75 145.25,27.25 145.25,26 144.75,25.5 143.75,25.5 VSLUE11.11 143.5,25.25 v138,25.25
  Route15 0.254: 115.25,25.25 116.5,24 OJ94.1 | 115.25,25.25 113,27.5 113,45 102.5,55.5 102.5,56.75 SV1.8 | 115.25,25.25 v138,25.25
GPIO_06_A4  (via drill 0.3)
  Top 0.254: VSLUE11.17 143.75,33 144.75,33 145.25,32.5 145.25,31 144.75,30.5 143.75,30.5 VSLUE11.15 143.5,30.25 v138,30.25
  Route2 0.254: SV1.9 99.75,54.25 100.75,54.25 102.25,52.75 105.25,52.75 123,35 123,27.5 126.5,24 OJ93.1 127.25,24 133.5,30.25 v138,30.25
GPIO_010_B6  (via drill 0.3)
  Top 0.254: 132.75,15 132.75,13.5 133.25,13 134.25,13 VSLUE5.4 | 132.75,15 133.25,15.5 134.25,15.5 VSLUE5.2 | 132.75,15 v132.75,16
  Route2 0.254: v132.75,16 113,35.75 113,37.25 102.5,47.75 102,47.75 101,46.75 99.75,46.75 SV1.15
  Route15 0.254: OJ47.1 158.75,4 146.75,16 v132.75,16
GPIO_10_F13
  Route15 0.254: SV2.2 56.25,16.25 56.25,17.5 13.75,60 13.75,67 J3.2
GPIO_011_A6  (via drill 0.3)
  Top 0.254: 133.25,10.25 132.75,9.75 132.75,8.5 133.25,8 134.25,8 VSLUE5.8 | 133.25,10.25 134.25,10.25 VSLUE5.6 | v132.75,10.75 133.25,10.25
  Route2 0.254: 133,11 140,4 OJ48.1 | 133,11 128,16 128,16.75 118.25,26.5 118.25,29.5 102.5,45.25 102.5,46.5 SV1.16 | 133,11 v132.75,10.75
GPIO_17_T11
  Route15 0.254: SV2.10 56.25,26.5 52.25,26.5 16.5,62.25 16.5,67 J3.3
GPIO_19_R11
  Route2 0.254: SV2.14 56.25,31.5 15.75,31.5 6.25,41 6.25,62.25 11,67 J3.1
GPIO_032_D12  (via drill 0.3)
  Top 0.254: VSLUE11.4 134.25,33 133.25,33 132.75,33.5 132.75,35 133.25,35.5 134.25,35.5 VSLUE11.2 134.5,35.25 135.5,35.25 136.5,34.25 v136.5,23
  Route15 0.254: SV1.39 99.75,16 101,16 102,15 116,15 124,23 v136.5,23 159.5,23 160.5,24 OJ95.1
GPIO_113_P9  (via drill 0.3)
  Top 0.254: VSLUE5.17 143.75,13 144.75,13 145.25,12.5 145.25,11 144.75,10.5 143.75,10.5 VSLUE5.15 143.5,10.25 v135.75,10.25
  Route2 0.254: SV2.18 56.5,36.25 57.75,36.25 59,35 65,35 97,3 125.5,3 126.5,4 OJ45.1
  Route15 0.254: v135.75,10.25 133.5,10.25 127.25,4 OJ45.1
GPIO_114_N9  (via drill 0.3)
  Top 0.254: 137.25,16.5 141.5,16.5 142.5,15.5 143.5,15.5 VSLUE5.19 | 137.25,16.5 134.5,16.5 VSLUE5.1 | LED1.A 144,65 R1.1 144,42.75 137.75,36.5 | 137.75,36.5 141.5,36.5 142.5,35.5 143.5,35.5 VSLUE11.19 | 137.75,36.5 137.25,36.5 | 137.25,36.5 134.5,36.5 VSLUE11.1 | 137.25,36.5 v137.25,32.25 137.25,16.5
  Route2 0.254: v137.25,32.25 131.25,32.25 105.75,57.75 77.5,57.75 59,39.25 SV2.19
  Route15 0.254: SV2.19 58.75,39.25 57.75,39.25 56.5,40.5 51.25,40.5 25.75,66 20,66 19,67 J3.4
GPIO_115_N11
  Top 0.254: VSLUE5.13 143.75,7.75 144.75,7.75 145.25,7.25 145.25,6 144.75,5.5 143.75,5.5 VSLUE5.11 143.5,5.25 136,5.25 133.25,2.5 118,2.5 116.5,4 OJ46.1
  Route2 0.254: OJ46.1 96.75,4 63.25,37.5 59,37.5 57.5,39 56.5,39 SV2.20
GPIO_118_R16  (3 unrouted)
  Route2 0.254: 30.5,40 31.25,40.75 46,40.75 48,42.75 56.5,42.75 57.75,44 58.75,44 SV2.23
GPIO_119_L15  (3 unrouted)
  Route2 0.254: 11.5,40 12.75,41.25 45.75,41.25 48.5,44 56.25,44 SV2.24
GPIO_121_P16  (3 unrouted)
  Top 0.254: 44.75,46.5 44,46.5 43.25,45.75 | 44.75,46.5 56.25,46.5 SV2.26 | 44.75,46.5 40.25,51
GPIO_126_L14  (via drill 0.3)
  Top 0.254: v100.25,69 105,69 116,58 116,57.5 U340G.3 | J7.2 40.75,67 49.75,58 57.75,58 58.75,57 SV2.33
  Route15 0.254: v100.25,69 78.75,69 66.75,57 59,57 SV2.33
GPIO_128_M10
  Route15 0.254: SV2.35 58.75,59.5 57.75,59.5 56.5,60.75 40.5,60.75 33.25,68 28.75,68 27.75,67 J12.2
GPIO_129_L13  (via drill 0.3)
  Top 0.254: v108.5,56 114.25,56 114.75,56.5 114.75,57.25 U340G.2 | J7.1 38.25,67 39.75,68.5 47.25,68.5 56.25,59.5 SV2.36
  Route2 0.254: v108.5,56 108.25,56 106,58.25 57.5,58.25 56.5,59.25 SV2.36
GPIO_130_J16
  Route2 0.254: SV2.37 58.75,62 57.75,62 56.5,63.25 29,63.25 25.25,67 J12.1
N$2  (2 unrouted)
N$8  (2 unrouted)
N$9
  Top 0.254: R8.1 LED1.C
N$14  (2 unrouted)
N$19  (2 unrouted)
N$23
  Top 0.254: C_OSC1.1 112.25,44 112.25,48 115.25,51 Y1.1 115.75,51 121,56.25 121,57.25 U340G.7
N$31
  Top 0.254: 120.75,51 120,50.25 120,44 C_OSC2.1 | 120.75,51 122.5,52.75 122.5,57.25 U340G.8 | 120.75,51 Y1.2
OUT21
  Top 0.254: VSLUE5.16 143.5,11.75 142.75,11.75 142,12.5 142,13.25 142.75,14 143.5,14 VSLUE5.18 143.75,14.25 149,14.25 150.5,15.75 152,15.75 153.5,14.25 160.75,14.25 B6.1 160.75,14 160.75,8.25 OJ44.1
OUT22
  Top 0.254: VSLUE5.12 143.5,6.75 142.5,6.75 142,7.25 142,8.25 142.75,9 143.5,9 VSLUE5.14 143.75,9 150,9 150.75,8.25 OJ43.1 151,8.25 151,14 A6.1
OUT23
  Top 0.254: VSLUE5.3 134.5,14 135.25,14 136,13.25 136,12.5 135.25,11.75 134.5,11.75 VSLUE5.5 134.25,11.75 131.5,11.75 129.5,13.75 127,13.75 P9.1 126.75,13.75 126.75,8.25 OJ41.1
OUT24
  Top 0.254: VSLUE5.7 134.5,9 135.25,9 136,8.25 136,7.25 135.5,6.75 134.5,6.75 VSLUE5.9 134.25,6.5 118.75,6.5 117.25,8 117,8 | 117,8 116.75,8 OJ42.1 117,8 | 117,8 117,13.75 N11.1
OUT45
  Top 0.254: VSLUE11.16 143.5,31.75 142.75,31.75 142,32.5 142,33.25 142.75,34 143.5,34 VSLUE11.18 143.75,34.25 149,34.25 150.5,35.75 152,35.75 153.5,34.25 160.75,34.25 D12.1 160.75,34 160.75,28.25 OJ92.1
OUT46
  Top 0.254: VSLUE11.12 143.5,26.75 142.5,26.75 142,27.25 142,28.25 142.75,29 143.5,29 VSLUE11.14 143.75,29 150,29 150.75,28.25 OJ91.1 151,28.25 151,34 B3.1
OUT47
  Top 0.254: VSLUE11.3 134.5,34 135.25,34 136,33.25 136,32.5 135.25,31.75 134.5,31.75 VSLUE11.5 134.25,31.75 131.5,31.75 129.5,33.75 127,33.75 A4.1 126.75,33.75 126.75,28.25 OJ89.1
OUT48
  Top 0.254: VSLUE11.7 134.5,29 135.25,29 136,28.25 136,27.25 135.5,26.75 134.5,26.75 VSLUE11.9 134.25,26.5 118.75,26.5 117.25,28 117,28 | 117,28 116.75,28 OJ90.1 117,28 | 117,28 117,33.75 B4.1
SLD
  Top 0.254: USB1.S4 115,67.75 115,70.25 USB1.S2 115,70.5 121.25,70.5 USB1.S1 121.5,70.25 121.5,67.75 USB1.S3

### Text on the board
tPlace: N9 (Outputs Enabled) | R11 | F13 | T11 | J16 | M10 | GND | 3V3 | L13 | L14 | GND | 5V | N9(OE) | de0-nano board | OUT | OUT | IN | IN | OUT | OUT | IN | IN | PMT de0-nano expander, v1.0 / by Dr. Andy Haas and Marc Gershow